# Altium schematic sheet RS485.SchDoc
size 420 x 297 mm; Organization: Altium Limited; Address1: L3, 12a Rodborough Rd; Address2: Frenchs Forest; Address3: NSW; Address4: Australia 2086
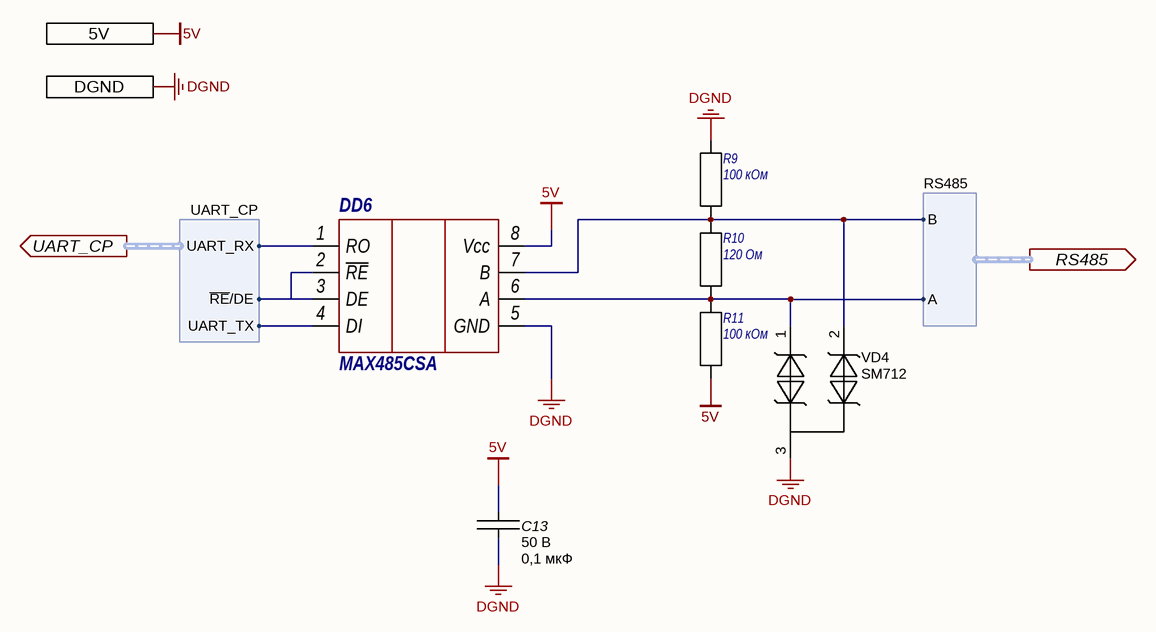
[diagram p0: RS485.SchDoc]

## Parts
C13  Voltage: 50 В  [C0603C]  (hidden comment: 0,1 мкФ)
DD6  MAX485CSA  [SOIC-8]
R9  100 кОм  [C0603R]
R10  120 Ом  [C0603R]
R11  100 кОм  [C0603R]
VD4  SM712  [SOT23-3]

## Ports
5V, DGND, RS485 (out, harness RS485), UART_CP (out, harness UART_CP)

## Harnesses
UART_CP: UART_TX, UART_RX, ~{RE}/DE
RS485: B, A

## Nets
5V: C13.1 DD6.8(Vcc) R11.2 ; port 5V
DGND: C13.2 DD6.5(GND) R9.1 VD4.3 ; port DGND
NetDD6_1: DD6.1(RO) ; port UART_CP.UART_RX
NetDD6_2: DD6.2(~{RE}) DD6.3(DE) ; port UART_CP.~{RE}/DE
NetDD6_4: DD6.4(DI) ; port UART_CP.UART_TX
NetDD6_6: DD6.6(A) R10.2 R11.1 VD4.1 ; port RS485.A
NetDD6_7: DD6.7(B) R9.2 R10.1 VD4.2 ; port RS485.B

## Notes on the sheet
- Подп. и дата
- Инв. № дубл.
- Взам. инв. №
- Инв. № подл.
- Изм.
- Лист
- № докум.
- Подп.
- Дата
- 2.106-A3
- Копировал
- Формат А3

## Library data of the parts
C13 = CC0603KRX7R9BB104: SMD 0603 ; X7R; 0,1 мкФ; 50 В; Manufacturer: YAGEO; Persent: ±5%; Type: Ceramic; Part Number: CC0603KRX7R9BB104; Package: SMD 0603; Dielectric: X7R; ComponentLink1Description: Datasheet; Value: 0,1 мкФ
DD6 = MAX485CSA: RS-485 приёмопередатчик; Part Number: MAX485CSA
R9 R11 = RC0603FR-07100KL: SMD 0603; 0,1; 1%; 100 кОм; Manufacturer: Yageo; Power: 0,1; Part Number: RC0603FR-07100KL; Package: SMD 0603; Persent: 1%; Value: 100 кОм; Category: R
R10 = RC0603FR-07120RL: SMD 0603; 0,1; 1%; 120 Ом; Manufacturer: Yageo; Power: 0,1; Part Number: RC0603FR-07120RL; Package: SMD 0603; Persent: 1%; Value: 120 Ом; Category: R
VD4 = SM712.TCT: TVS RS485; Manufacturer: Semtech; Part Number: SM712.TCT; Type: TVS